# EAGLE schematic 7seg_interface_unit (EAGLE 9.5.2)
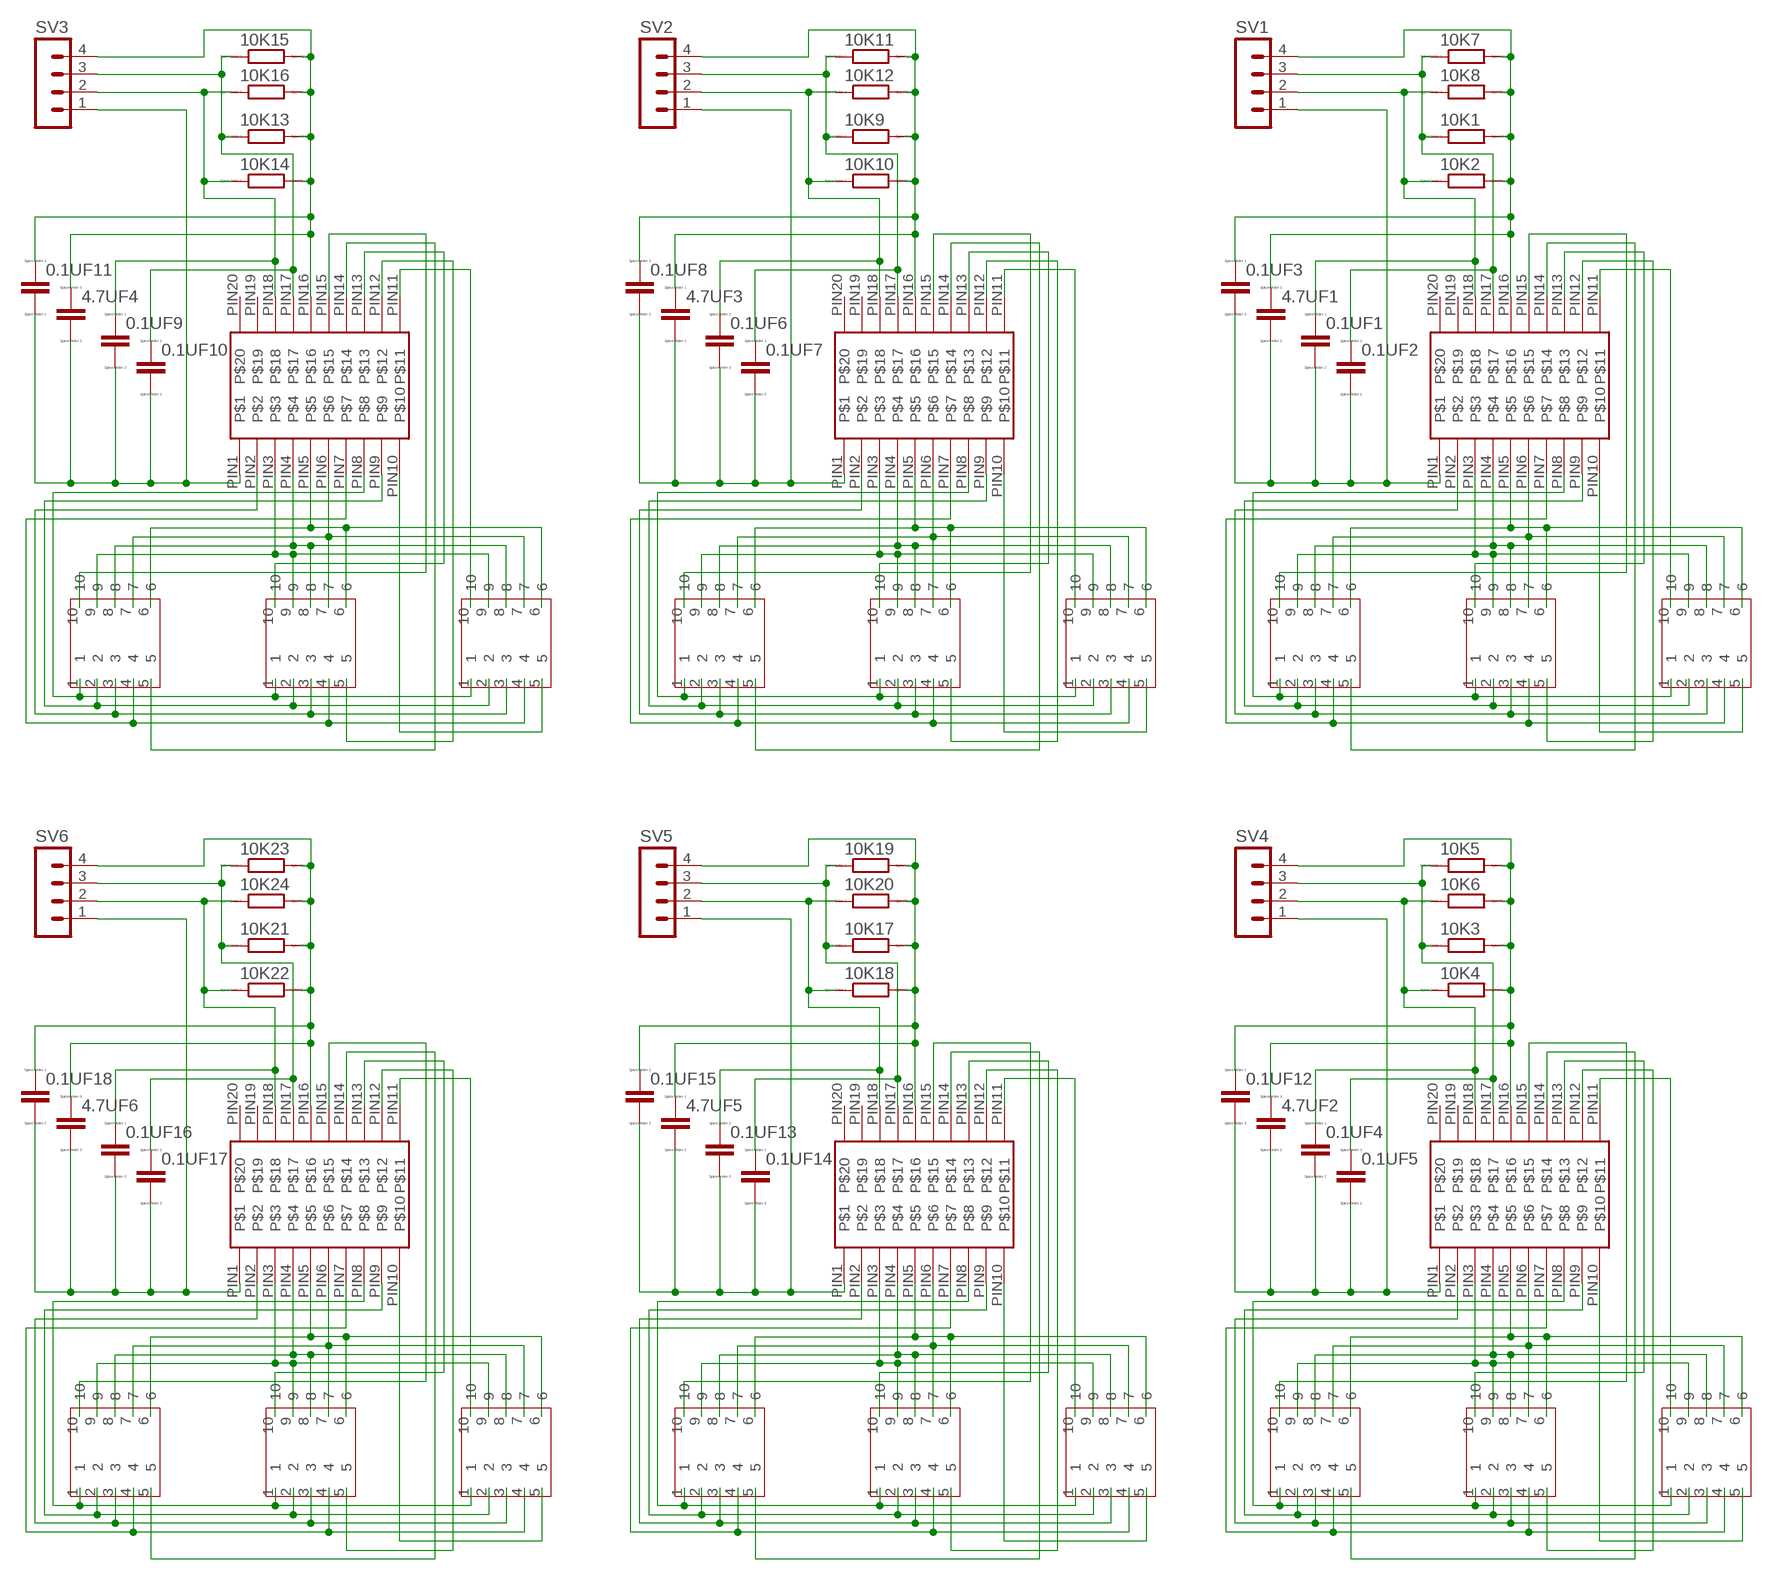
[diagram p0: schematic, sheet 1]

## Parts
0.1UF1  CC1206  [C1206]
0.1UF2  CC1206  [C1206]
0.1UF3  CC1206  [C1206]
0.1UF4  CC1206  [C1206]
0.1UF5  CC1206  [C1206]
0.1UF6  CC1206  [C1206]
0.1UF7  CC1206  [C1206]
0.1UF8  CC1206  [C1206]
0.1UF9  CC1206  [C1206]
0.1UF10  CC1206  [C1206]
0.1UF11  CC1206  [C1206]
0.1UF12  CC1206  [C1206]
0.1UF13  CC1206  [C1206]
0.1UF14  CC1206  [C1206]
0.1UF15  CC1206  [C1206]
0.1UF16  CC1206  [C1206]
0.1UF17  CC1206  [C1206]
0.1UF18  CC1206  [C1206]
4.7UF1  CC2012  [C2012]
4.7UF2  CC2012  [C2012]
4.7UF3  CC2012  [C2012]
4.7UF4  CC2012  [C2012]
4.7UF5  CC2012  [C2012]
4.7UF6  CC2012  [C2012]
10K1  RR1206  [R1206]
10K2  RR1206  [R1206]
10K3  RR1206  [R1206]
10K4  RR1206  [R1206]
10K5  RR1206  [R1206]
10K6  RR1206  [R1206]
10K7  RR1206  [R1206]
10K8  RR1206  [R1206]
10K9  RR1206  [R1206]
10K10  RR1206  [R1206]
10K11  RR1206  [R1206]
10K12  RR1206  [R1206]
10K13  RR1206  [R1206]
10K14  RR1206  [R1206]
10K15  RR1206  [R1206]
10K16  RR1206  [R1206]
10K17  RR1206  [R1206]
10K18  RR1206  [R1206]
10K19  RR1206  [R1206]
10K20  RR1206  [R1206]
10K21  RR1206  [R1206]
10K22  RR1206  [R1206]
10K23  RR1206  [R1206]
10K24  RR1206  [R1206]
LED1  7SEG  [7SEG]
LED2  7SEG  [7SEG]
LED3  7SEG  [7SEG]
LED4  7SEG  [7SEG]
LED5  7SEG  [7SEG]
LED6  7SEG  [7SEG]
LED7  7SEG  [7SEG]
LED8  7SEG  [7SEG]
LED9  7SEG  [7SEG]
LED10  7SEG  [7SEG]
LED11  7SEG  [7SEG]
LED12  7SEG  [7SEG]
LED13  7SEG  [7SEG]
LED14  7SEG  [7SEG]
LED15  7SEG  [7SEG]
LED16  7SEG  [7SEG]
LED17  7SEG  [7SEG]
LED18  7SEG  [7SEG]
SV1  MA04-1  [MA04-1]
SV2  MA04-1  [MA04-1]
SV3  MA04-1  [MA04-1]
SV4  MA04-1  [MA04-1]
SV5  MA04-1  [MA04-1]
SV6  MA04-1  [MA04-1]
TM1637-SMD1  TM1637  [TM1637]
TM1637-SMD2  TM1637  [TM1637]
TM1637-SMD3  TM1637  [TM1637]
TM1637-SMD4  TM1637  [TM1637]
TM1637-SMD5  TM1637  [TM1637]
TM1637-SMD6  TM1637  [TM1637]

## Nets
N$1: LED1.1 LED2.1 LED3.1 TM1637-SMD1.PIN8
N$2: LED1.2 LED2.2 LED3.2 TM1637-SMD1.PIN9
N$3: LED1.3 LED2.3 LED3.3 TM1637-SMD1.PIN2
N$4: LED10.1 LED11.1 LED12.1 TM1637-SMD4.PIN8
N$5: LED10.2 LED11.2 LED12.2 TM1637-SMD4.PIN9
N$6: LED1.4 LED2.4 LED3.4 TM1637-SMD1.PIN7
N$7: LED10.3 LED11.3 LED12.3 TM1637-SMD4.PIN2
N$8: LED1.6 LED2.6 LED3.6 TM1637-SMD1.PIN5
N$9: LED1.7 LED2.7 LED3.7 TM1637-SMD1.PIN6
N$10: LED10.4 LED11.4 LED12.4 TM1637-SMD4.PIN7
N$11: LED1.8 LED2.8 LED3.8 TM1637-SMD1.PIN4
N$12: LED1.9 LED2.9 LED3.9 TM1637-SMD1.PIN3
N$13: LED3.5 TM1637-SMD1.PIN10
N$14: LED3.10 TM1637-SMD1.PIN11
N$15: LED2.5 TM1637-SMD1.PIN12
N$16: LED2.10 TM1637-SMD1.PIN13
N$17: LED1.5 TM1637-SMD1.PIN14
N$18: LED1.10 TM1637-SMD1.PIN15
N$19: 0.1UF1.1 10K2.1 10K8.1 SV1.2 TM1637-SMD1.PIN18
N$20: 0.1UF2.1 10K1.1 10K7.1 SV1.3 TM1637-SMD1.PIN17
N$21: 0.1UF3.1 4.7UF1.1 10K1.2 10K2.2 10K7.2 10K8.2 SV1.4 TM1637-SMD1.PIN16
N$22: 0.1UF1.2 0.1UF2.2 0.1UF3.2 4.7UF1.2 SV1.1 TM1637-SMD1.PIN1
N$23: LED4.1 LED5.1 LED6.1 TM1637-SMD2.PIN8
N$24: LED4.2 LED5.2 LED6.2 TM1637-SMD2.PIN9
N$25: LED4.3 LED5.3 LED6.3 TM1637-SMD2.PIN2
N$26: LED4.4 LED5.4 LED6.4 TM1637-SMD2.PIN7
N$27: LED4.6 LED5.6 LED6.6 TM1637-SMD2.PIN5
N$28: LED4.7 LED5.7 LED6.7 TM1637-SMD2.PIN6
N$29: LED4.8 LED5.8 LED6.8 TM1637-SMD2.PIN4
N$30: LED4.9 LED5.9 LED6.9 TM1637-SMD2.PIN3
N$31: LED5.5 TM1637-SMD2.PIN10
N$32: LED5.10 TM1637-SMD2.PIN11
N$33: LED4.5 TM1637-SMD2.PIN12
N$34: LED10.6 LED11.6 LED12.6 TM1637-SMD4.PIN5
N$35: LED4.10 TM1637-SMD2.PIN13
N$36: LED6.5 TM1637-SMD2.PIN14
N$37: LED6.10 TM1637-SMD2.PIN15
N$38: 0.1UF6.1 10K10.1 10K12.1 SV2.2 TM1637-SMD2.PIN18
N$39: 0.1UF7.1 10K9.1 10K11.1 SV2.3 TM1637-SMD2.PIN17
N$40: 0.1UF8.1 4.7UF3.1 10K9.2 10K10.2 10K11.2 10K12.2 SV2.4 TM1637-SMD2.PIN16
N$41: 0.1UF6.2 0.1UF7.2 0.1UF8.2 4.7UF3.2 SV2.1 TM1637-SMD2.PIN1
N$42: LED7.1 LED8.1 LED9.1 TM1637-SMD3.PIN8
N$43: LED7.2 LED8.2 LED9.2 TM1637-SMD3.PIN9
N$44: LED10.7 LED11.7 LED12.7 TM1637-SMD4.PIN6
N$45: LED7.3 LED8.3 LED9.3 TM1637-SMD3.PIN2
N$46: LED7.4 LED8.4 LED9.4 TM1637-SMD3.PIN7
N$47: LED7.6 LED8.6 LED9.6 TM1637-SMD3.PIN5
N$48: LED7.7 LED8.7 LED9.7 TM1637-SMD3.PIN6
N$49: LED7.8 LED8.8 LED9.8 TM1637-SMD3.PIN4
N$50: LED7.9 LED8.9 LED9.9 TM1637-SMD3.PIN3
N$51: LED8.5 TM1637-SMD3.PIN10
N$52: LED8.10 TM1637-SMD3.PIN11
N$53: LED7.5 TM1637-SMD3.PIN12
N$54: LED7.10 TM1637-SMD3.PIN13
N$55: LED9.5 TM1637-SMD3.PIN14
N$56: LED9.10 TM1637-SMD3.PIN15
N$57: 0.1UF9.1 10K14.1 10K16.1 SV3.2 TM1637-SMD3.PIN18
N$58: 0.1UF10.1 10K13.1 10K15.1 SV3.3 TM1637-SMD3.PIN17
N$59: 0.1UF11.1 4.7UF4.1 10K13.2 10K14.2 10K15.2 10K16.2 SV3.4 TM1637-SMD3.PIN16
N$60: 0.1UF9.2 0.1UF10.2 0.1UF11.2 4.7UF4.2 SV3.1 TM1637-SMD3.PIN1
N$61: LED10.8 LED11.8 LED12.8 TM1637-SMD4.PIN4
N$62: LED10.9 LED11.9 LED12.9 TM1637-SMD4.PIN3
N$63: LED11.5 TM1637-SMD4.PIN10
N$64: LED11.10 TM1637-SMD4.PIN11
N$65: LED10.5 TM1637-SMD4.PIN12
N$66: LED10.10 TM1637-SMD4.PIN13
N$67: LED12.5 TM1637-SMD4.PIN14
N$68: LED12.10 TM1637-SMD4.PIN15
N$69: 0.1UF4.1 10K4.1 10K6.1 SV4.2 TM1637-SMD4.PIN18
N$70: 0.1UF5.1 10K3.1 10K5.1 SV4.3 TM1637-SMD4.PIN17
N$71: 0.1UF12.1 4.7UF2.1 10K3.2 10K4.2 10K5.2 10K6.2 SV4.4 TM1637-SMD4.PIN16
N$72: 0.1UF4.2 0.1UF5.2 0.1UF12.2 4.7UF2.2 SV4.1 TM1637-SMD4.PIN1
N$73: LED13.1 LED14.1 LED15.1 TM1637-SMD5.PIN8
N$74: LED13.2 LED14.2 LED15.2 TM1637-SMD5.PIN9
N$75: LED13.3 LED14.3 LED15.3 TM1637-SMD5.PIN2
N$76: LED13.4 LED14.4 LED15.4 TM1637-SMD5.PIN7
N$77: LED13.6 LED14.6 LED15.6 TM1637-SMD5.PIN5
N$78: LED13.7 LED14.7 LED15.7 TM1637-SMD5.PIN6
N$79: LED13.8 LED14.8 LED15.8 TM1637-SMD5.PIN4
N$80: LED13.9 LED14.9 LED15.9 TM1637-SMD5.PIN3
N$81: LED14.5 TM1637-SMD5.PIN10
N$82: LED14.10 TM1637-SMD5.PIN11
N$83: LED13.5 TM1637-SMD5.PIN12
N$84: LED13.10 TM1637-SMD5.PIN13
N$85: LED15.5 TM1637-SMD5.PIN14
N$86: LED15.10 TM1637-SMD5.PIN15
N$87: 0.1UF13.1 10K18.1 10K20.1 SV5.2 TM1637-SMD5.PIN18
N$88: 0.1UF14.1 10K17.1 10K19.1 SV5.3 TM1637-SMD5.PIN17
N$89: 0.1UF15.1 4.7UF5.1 10K17.2 10K18.2 10K19.2 10K20.2 SV5.4 TM1637-SMD5.PIN16
N$90: 0.1UF13.2 0.1UF14.2 0.1UF15.2 4.7UF5.2 SV5.1 TM1637-SMD5.PIN1
N$91: LED16.1 LED17.1 LED18.1 TM1637-SMD6.PIN8
N$92: LED16.2 LED17.2 LED18.2 TM1637-SMD6.PIN9
N$93: LED16.3 LED17.3 LED18.3 TM1637-SMD6.PIN2
N$94: LED16.4 LED17.4 LED18.4 TM1637-SMD6.PIN7
N$95: LED16.6 LED17.6 LED18.6 TM1637-SMD6.PIN5
N$96: LED16.7 LED17.7 LED18.7 TM1637-SMD6.PIN6
N$97: LED16.8 LED17.8 LED18.8 TM1637-SMD6.PIN4
N$98: LED16.9 LED17.9 LED18.9 TM1637-SMD6.PIN3
N$99: LED17.5 TM1637-SMD6.PIN10
N$100: LED17.10 TM1637-SMD6.PIN11
N$101: LED16.5 TM1637-SMD6.PIN12
N$102: LED16.10 TM1637-SMD6.PIN13
N$103: LED18.5 TM1637-SMD6.PIN14
N$104: LED18.10 TM1637-SMD6.PIN15
N$105: 0.1UF16.1 10K22.1 10K24.1 SV6.2 TM1637-SMD6.PIN18
N$106: 0.1UF17.1 10K21.1 10K23.1 SV6.3 TM1637-SMD6.PIN17
N$107: 0.1UF18.1 4.7UF6.1 10K21.2 10K22.2 10K23.2 10K24.2 SV6.4 TM1637-SMD6.PIN16
N$108: 0.1UF16.2 0.1UF17.2 0.1UF18.2 4.7UF6.2 SV6.1 TM1637-SMD6.PIN1
Unconnected: TM1637-SMD1.PIN19 TM1637-SMD1.PIN20 TM1637-SMD2.PIN19 TM1637-SMD2.PIN20 TM1637-SMD3.PIN19 TM1637-SMD3.PIN20 TM1637-SMD4.PIN19 TM1637-SMD4.PIN20 TM1637-SMD5.PIN19 TM1637-SMD5.PIN20 TM1637-SMD6.PIN19 TM1637-SMD6.PIN20

## Library data of the parts
0.1UF1-0.1UF18 4.7UF1-4.7UF6 = eagle-ltspice:C: CAPACITOR, European symbol; SPICEMODEL: NONE; SPICEPREFIX: C
10K1-10K24 = eagle-ltspice:R: RESISTOR, European symbol; SPICEMODEL: NONE; SPICEPREFIX: R
LED1-LED18 = 7seg-led:7SEG: 7seg
SV1-SV6 = con-lstb:MA04-1: PIN HEADER; OC_FARNELL: unknown; OC_NEWARK: unknown
TM1637-SMD1-TM1637-SMD6 = tm1637:TM1637: TM1637-smd library

## Net classes
0 default: width 0.178 mm, clearance 0.127 mm